# Altium schematic sheet MainIC.SchDoc: Soldeerstation
size A4; DrawnBy: Miguel Nunez; DocumentNumber: 2022/001; Revision: v1; SheetNumber: 5; SheetTotal: 6
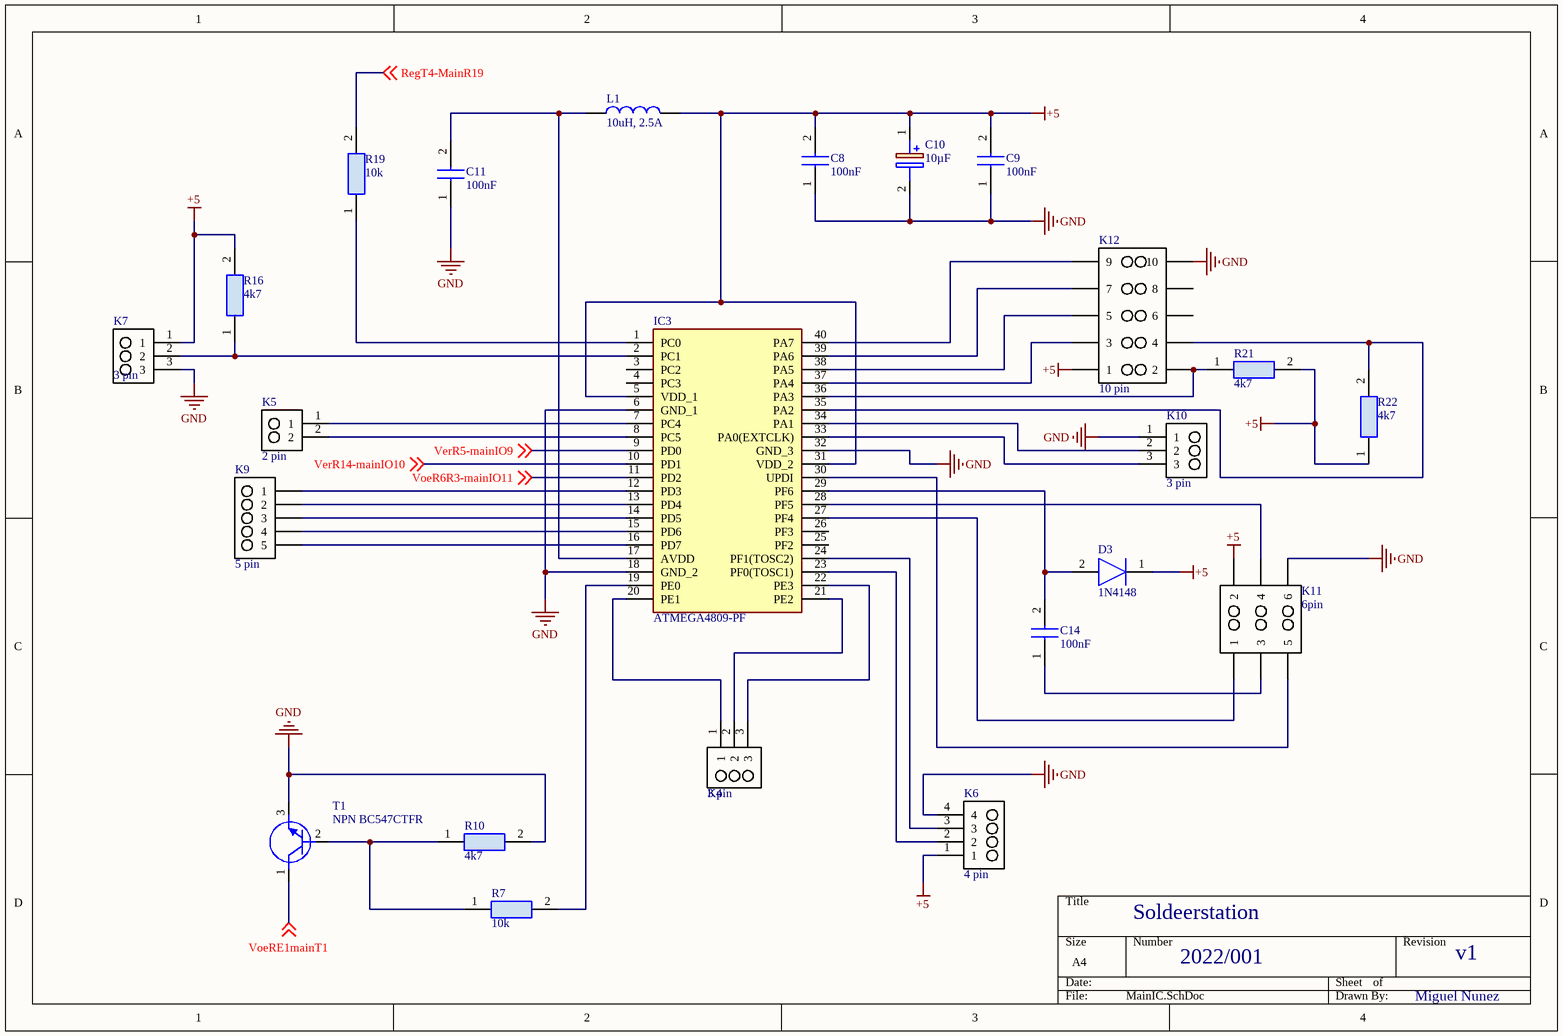
[diagram p0: MainIC.SchDoc]

## Parts
C8  100nF  [WCAP-CSGP_0805_L2W1.25H0.8_Reflow]
C9  100nF  [WCAP-CSGP_0805_L2W1.25H0.8_Reflow]
C10  10µF  [WCAP-AT1H_D5H11]
C11  100nF  [WCAP-CSGP_0805_L2W1.25H0.8_Reflow]
C14  100nF  [WCAP-CSGP_0805_L2W1.25H0.8_Reflow]
D3  1N4148  [DIOAD1165W56L425D185]
IC3  ATMEGA4809-PF  [DIP1543W58P254L5175H635Q40N]
K4  3 pin  [691214310003]
K5  2 pin  [691214110002]
K6  4 pin  [SHDR4W78P0X254_1X4_1026X252X700P]
K7  3 pin  [691214310003]
K9  5 pin  [215297-5_TYC]
K10  3 pin  [691214310003]
K11  6pin  [215307-3_TYC]
K12  10 pin  [215307-5_TYC]
L1  10uH, 2.5A  [744711003]
R7  10k  [RESC2012X60N]
R10  4k7  [CAPC2012X65N]
R16  4k7  [CAPC2012X65N]
R19  10k  [RESC2012X60N]
R21  4k7  [CAPC2012X65N]
R22  4k7  [CAPC2012X65N]
T1  NPN BC547CTFR  [BC33740TA]

## Nets
+5: C8.2 C9.2 C10.1(+) D3.1(K) IC3.5(VDD_1) IC3.31(VDD_2) K6.1 K7.1 K11.2 K12.1 L1.2 R16.2 R21.2 R22.1
GND: C8.1 C9.1 C10.2(-) C11.1 IC3.6(GND_1) IC3.18(GND_2) IC3.32(GND_3) K6.4 K7.3 K10.1 K11.6 K12.10 R10.2 T1.3(E)
RegT4-MainR19: R19.2 ; off-sheet RegT4-MainR19
VerR5-mainIO9: IC3.9(PD0) ; off-sheet VerR5-mainIO9
VerR14-mainIO10: IC3.10(PD1) ; off-sheet VerR14-mainIO10
VoeR6R3-mainIO11: IC3.11(PD2) ; off-sheet VoeR6R3-mainIO11
VoeRE1mainT1: T1.1(C) ; off-sheet VoeRE1mainT1
NetC11_2: C11.2 IC3.17(AVDD) L1.1
NetC14_1: C14.1 K11.3
NetC14_2: C14.2 D3.2(A) IC3.29(PF6)
NetIC3_1: IC3.1(PC0) R19.1
NetIC3_2: IC3.2(PC1) K7.2 R16.1
NetIC3_7: IC3.7(PC4) K5.1
NetIC3_8: IC3.8(PC5) K5.2
NetIC3_12: IC3.12(PD3) K9.1
NetIC3_13: IC3.13(PD4) K9.2
NetIC3_14: IC3.14(PD5) K9.3
NetIC3_15: IC3.15(PD6) K9.4
NetIC3_16: IC3.16(PD7) K9.5
NetIC3_19: IC3.19(PE0) R7.2
NetIC3_20: IC3.20(PE1) K4.1
NetIC3_21: IC3.21(PE2) K4.2
NetIC3_22: IC3.22(PE3) K4.3
NetIC3_23: IC3.23(PF0(TOSC1)) K6.2
NetIC3_24: IC3.24(PF1(TOSC2)) K6.3
NetIC3_27: IC3.27(PF4) K11.1
NetIC3_28: IC3.28(PF5) K11.4
NetIC3_30: IC3.30(UPDI) K11.5
NetIC3_33: IC3.33(PA0(EXTCLK)) K10.3
NetIC3_34: IC3.34(PA1) K10.2
NetIC3_35: IC3.35(PA2) K12.4 R22.2
NetIC3_36: IC3.36(PA3) K12.2 R21.1
NetIC3_37: IC3.37(PA4) K12.3
NetIC3_38: IC3.38(PA5) K12.5
NetIC3_39: IC3.39(PA6) K12.7
NetIC3_40: IC3.40(PA7) K12.9
NetR7_1: R7.1 R10.1 T1.2(B)

Not connected (* = marked no-connect by the designer): IC3 3(PC2) 4(PC3) 25(PF2) 26(PF3); K12 6 8

## Library data of the parts
C8 C9 C11 C14 = CAP 0.1µF (100nF): Capacitor C0805C104K8RACAUTO; Manufacturer_Name: Kemet; Datasheet Link: https://ad.componentsearchengine.com/Datasheets/2/C0805C104K8RACAUTO.pdf; Height: 0.88mm; Manufacturer_Part_Number: C0805C104K8RACAUTO
C10 = ELCAP 10µF: Capacitor Polarised Wurth Elektronik 860240672002 10µF; Datasheet Link: https://katalog.we-online.de/pbs/datasheet/860240672002.pdf; Height: 12.5mm; Manufacturer_Name: Wurth Elektronik; Manufacturer_Part_Number: 860240672002
D3 = D 1N4148: Diode 1N4148 100V, 200mA; Manufacturer_Name: Nexperia; Datasheet Link: https://datasheet.datasheetarchive.com/originals/distributors/Datasheets-112/DSAP0040891.pdf; Manufacturer_Part_Number: 1N4148
IC3 = ATMEGA4809-PF: Integrated Circuit; Manufacturer_Name: Microchip; Datasheet Link: https://componentsearchengine.com//ATMEGA4809-PF.pdf; Height: 6.35mm; Mouser2 Part Number: 556-ATMEGA4809-PF; Mouser2 Price/Stock: https://www.mouser.com/Search/Refine.aspx?Keyword=556-ATMEGA4809-PF; Manufacturer_Part_Number: ATMEGA4809-PF
K4 K7 K10 = Header 1x3pin: Connector 61900311121 3 pin; Manufacturer_Name: Wurth Elektronik; Datasheet Link: https://katalog.we-online.de/em/datasheet/61900311121.pdf; Height: 11.75mm; Manufacturer_Part_Number: 61900311121
K5 = Header 1x2pin: Connector 2 pin 212520-1002; Manufacturer_Name: Molex; Datasheet Link: https://www.molex.com/pdm_docs/sd/2125201002_sd.pdf; Height: 13.6mm; Manufacturer_Part_Number: 212520-1002
K6 = Header 1x4pin: Connector 216571-3004 1x4 pin; Manufacturer_Name: Molex; Datasheet Link: https://www.molex.com/pdm_docs/sd/2165711002_sd.pdf; Height: 9.91mm; Manufacturer_Part_Number: 216571-3004
K9 = Header 1x 5pin: Header, 5-Pin; LatestRevisionDate: 17-Jul-2002; LatestRevisionNote: Re-released for DXP Platform.; Publisher: Altium Limited
K11 = Header 2x3: Header, 3-Pin, Dual row; LatestRevisionDate: 17-Jul-2002; LatestRevisionNote: Re-released for DXP Platform.; Publisher: Altium Limited
K12 = Header 2x5: Header, 5-Pin, Dual row; LatestRevisionDate: 17-Jul-2002; LatestRevisionNote: Re-released for DXP Platform.; Publisher: Altium Limited
L1 = spoel WE klein: WE-SD THT Rod Core Choke, 10uH, 2.5A  744711003; Manufacturer: Wurth Elektronik; DC Resistance: 33mOhm; ComponentLink1Description: Manufacturer; ComponentLink1URL: http://www.we-online.de; ComponentLink2Description: Datasheet; ComponentLink2URL: https://www.we-online.com/catalog/datasheet/744711003.pdf; Operating Temperature: -40 to +150degC; Packaging: Carton; Published Date: May 2021; Inductance: 10uH; Manufacturer Part Number: 744711003; Mounting Technology: THT; Rated Current: 2.5A
R7 R19 = RES 10k 0805: 10k SMD 0805  CR0805-FX-1002ELF; Manufacturer_Name: Bourns; Datasheet Link: https://componentsearchengine.com//CR0805-FX-1002ELF.pdf; Height: 0.6mm; Mouser2 Part Number: 652-CR0805FX-1002ELF; Mouser2 Price/Stock: https://www.mouser.com/Search/Refine.aspx?Keyword=652-CR0805FX-1002ELF; Manufacturer_Part_Number: CR0805-FX-1002ELF
R10 R16 R21 R22 = RES 4k7 0805: 4k7 SMD 0805  ESR10EZPJ472; Manufacturer_Name: ROHM Semiconductor; Datasheet Link: https://componentsearchengine.com/Datasheets/2/ESR10EZPJ472.pdf; Height: 0.65mm; Manufacturer_Part_Number: ESR10EZPJ472
T1 = TR BC547CTFR: Transistor BC547CTFR NPN; Mfr_Name: onsemi; Type: DEV; Copyright: Copyright (C) 2022 Ultra Librarian. All rights reserved.; Manufacturer_Part_Number: BC547CTFR; RefDes: RefDes